# Altium schematic sheet GZ7_1_x-ZON.SchDoc: GZ8-4-0
size B; SheetNumber: 10; SheetTotal: 10
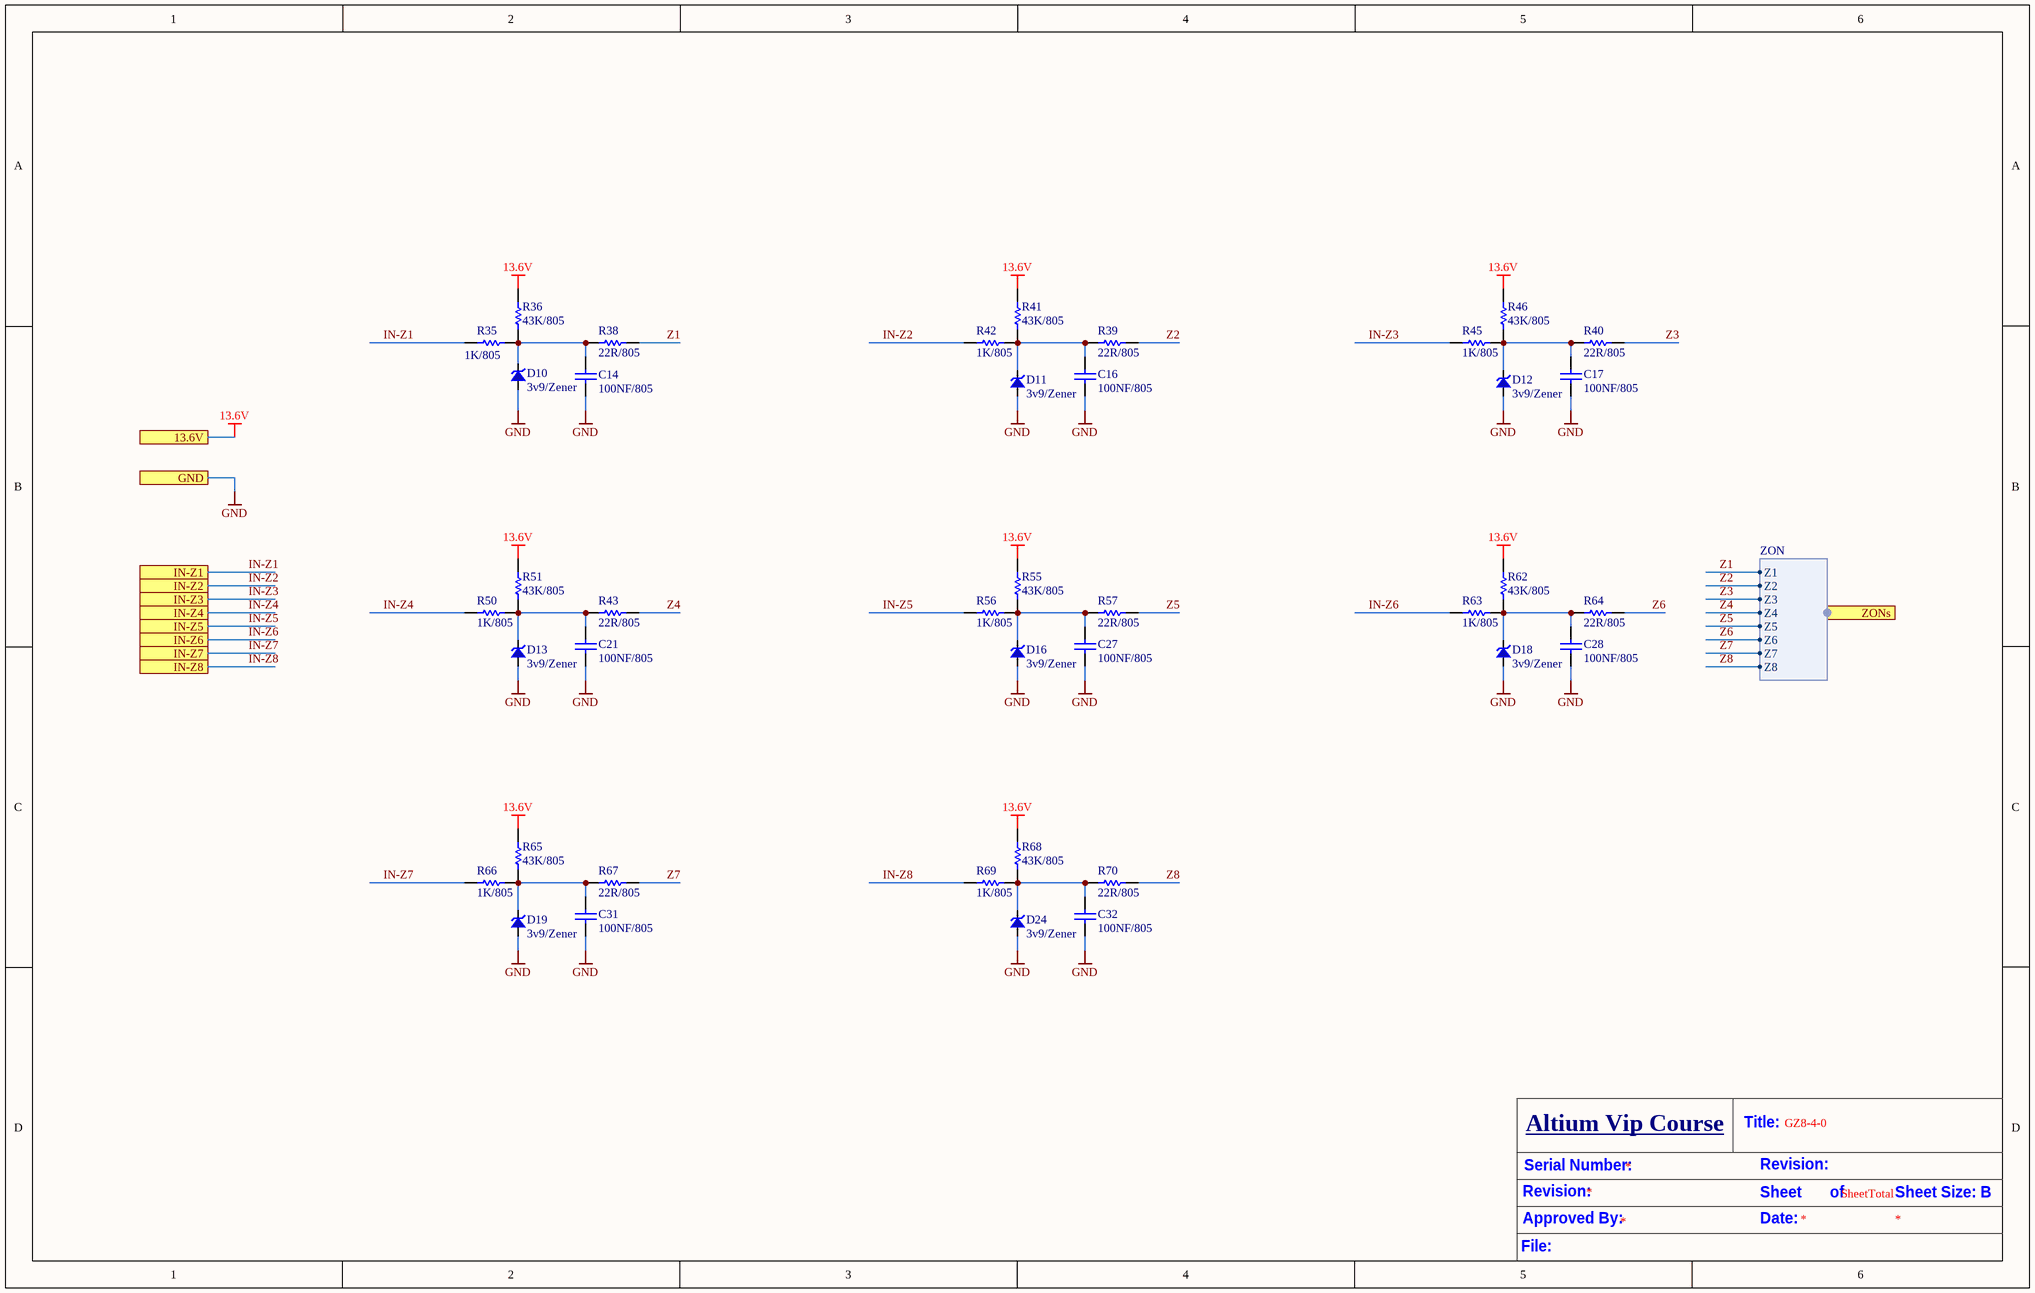
[diagram p0: GZ7_1_x-ZON.SchDoc]

## Parts
C14  100NF/805  [MY805 COP]
C16  100NF/805  [MY805 COP]
C17  100NF/805  [MY805 COP]
C21  100NF/805  [MY805 COP]
C27  100NF/805  [MY805 COP]
C28  100NF/805  [MY805 COP]
C31  100NF/805  [MY805 COP]
C32  100NF/805  [MY805 COP]
D10  3v9/Zener  [my-DO5X.1.5]
D11  3v9/Zener  [my-DO5X.1.5]
D12  3v9/Zener  [my-DO5X.1.5]
D13  3v9/Zener  [my-DO5X.1.5]
D16  3v9/Zener  [my-DO5X.1.5]
D18  3v9/Zener  [my-DO5X.1.5]
D19  3v9/Zener  [my-DO5X.1.5]
D24  3v9/Zener  [my-DO5X.1.5]
R35  1K/805  [my805]
R36  43K/805  [my805]
R38  22R/805  [my805]
R39  22R/805  [my805]
R40  22R/805  [my805]
R41  43K/805  [my805]
R42  1K/805  [my805]
R43  22R/805  [my805]
R45  1K/805  [my805]
R46  43K/805  [my805]
R50  1K/805  [my805]
R51  43K/805  [my805]
R55  43K/805  [my805]
R56  1K/805  [my805]
R57  22R/805  [my805]
R62  43K/805  [my805]
R63  1K/805  [my805]
R64  22R/805  [my805]
R65  43K/805  [my805]
R66  1K/805  [my805]
R67  22R/805  [my805]
R68  43K/805  [my805]
R69  1K/805  [my805]
R70  22R/805  [my805]

## Ports
13.6V, GND, IN-Z1, IN-Z2, IN-Z3, IN-Z4, IN-Z5, IN-Z6, IN-Z7, IN-Z8, ZONs (harness ZON)

## Harnesses
ZON: Z1, Z2, Z3, Z4, Z5, Z6, Z7, Z8

## Nets
13.6V: R36.1 R41.1 R46.1 R51.1 R55.1 R62.1 R65.1 R68.1 ; port 13.6V
GND: C14.1 C16.1 C17.1 C21.1 C27.1 C28.1 C31.1 C32.1 D10.1 D11.1 D12.1 D13.1 D16.1 D18.1 D19.1 D24.1 ; port GND
IN-Z1: R35.1 ; port IN-Z1
IN-Z2: R42.1 ; port IN-Z2
IN-Z3: R45.1 ; port IN-Z3
IN-Z4: R50.1 ; port IN-Z4
IN-Z5: R56.1 ; port IN-Z5
IN-Z6: R63.1 ; port IN-Z6
IN-Z7: R66.1 ; port IN-Z7
IN-Z8: R69.1 ; port IN-Z8
Z1: R38.1 ; port ZONs.Z1
Z2: R39.1 ; port ZONs.Z2
Z3: R40.1 ; port ZONs.Z3
Z4: R43.1 ; port ZONs.Z4
Z5: R57.1 ; port ZONs.Z5
Z6: R64.1 ; port ZONs.Z6
Z7: R67.1 ; port ZONs.Z7
Z8: R70.1 ; port ZONs.Z8
NetC14_2: C14.2 D10.2 R35.2 R36.2 R38.2
NetC16_2: C16.2 D11.2 R39.2 R41.2 R42.2
NetC17_2: C17.2 D12.2 R40.2 R45.2 R46.2
NetC21_2: C21.2 D13.2 R43.2 R50.2 R51.2
NetC27_2: C27.2 D16.2 R55.2 R56.2 R57.2
NetC28_2: C28.2 D18.2 R62.2 R63.2 R64.2
NetC31_2: C31.2 D19.2 R65.2 R66.2 R67.2
NetC32_2: C32.2 D24.2 R68.2 R69.2 R70.2

## Notes on the sheet
- Serial Number:
- Altium Vip Course
- Title:
- Revision:
- Approved By:
- Date:
- Sheet       of
- SheetTotal
- Sheet Size: B
- File:

## Library data of the parts
C14 C16 C17 C21 C27 C28 C31 C32 = CAP SMD 0805: CAP 0805; Designer: Abbas Basereh; Desc.: CAP SMD 0805; Data: 16-12-2016
D10-D13 D16 D18 D19 D24 = Zener
R35 R36 R38-R43 R45 R50 R51 R55-R57 R62-R70 = RES 1206 0.25W: RES 805; Designer: Abbas Basereh; Desc.: RES SMD 1206; Data: 16-12-2016
R46 = RES 1206 0.25W: RES 805